# Altium schematic sheet Mother Board Main.SchDoc
size A3 portrait
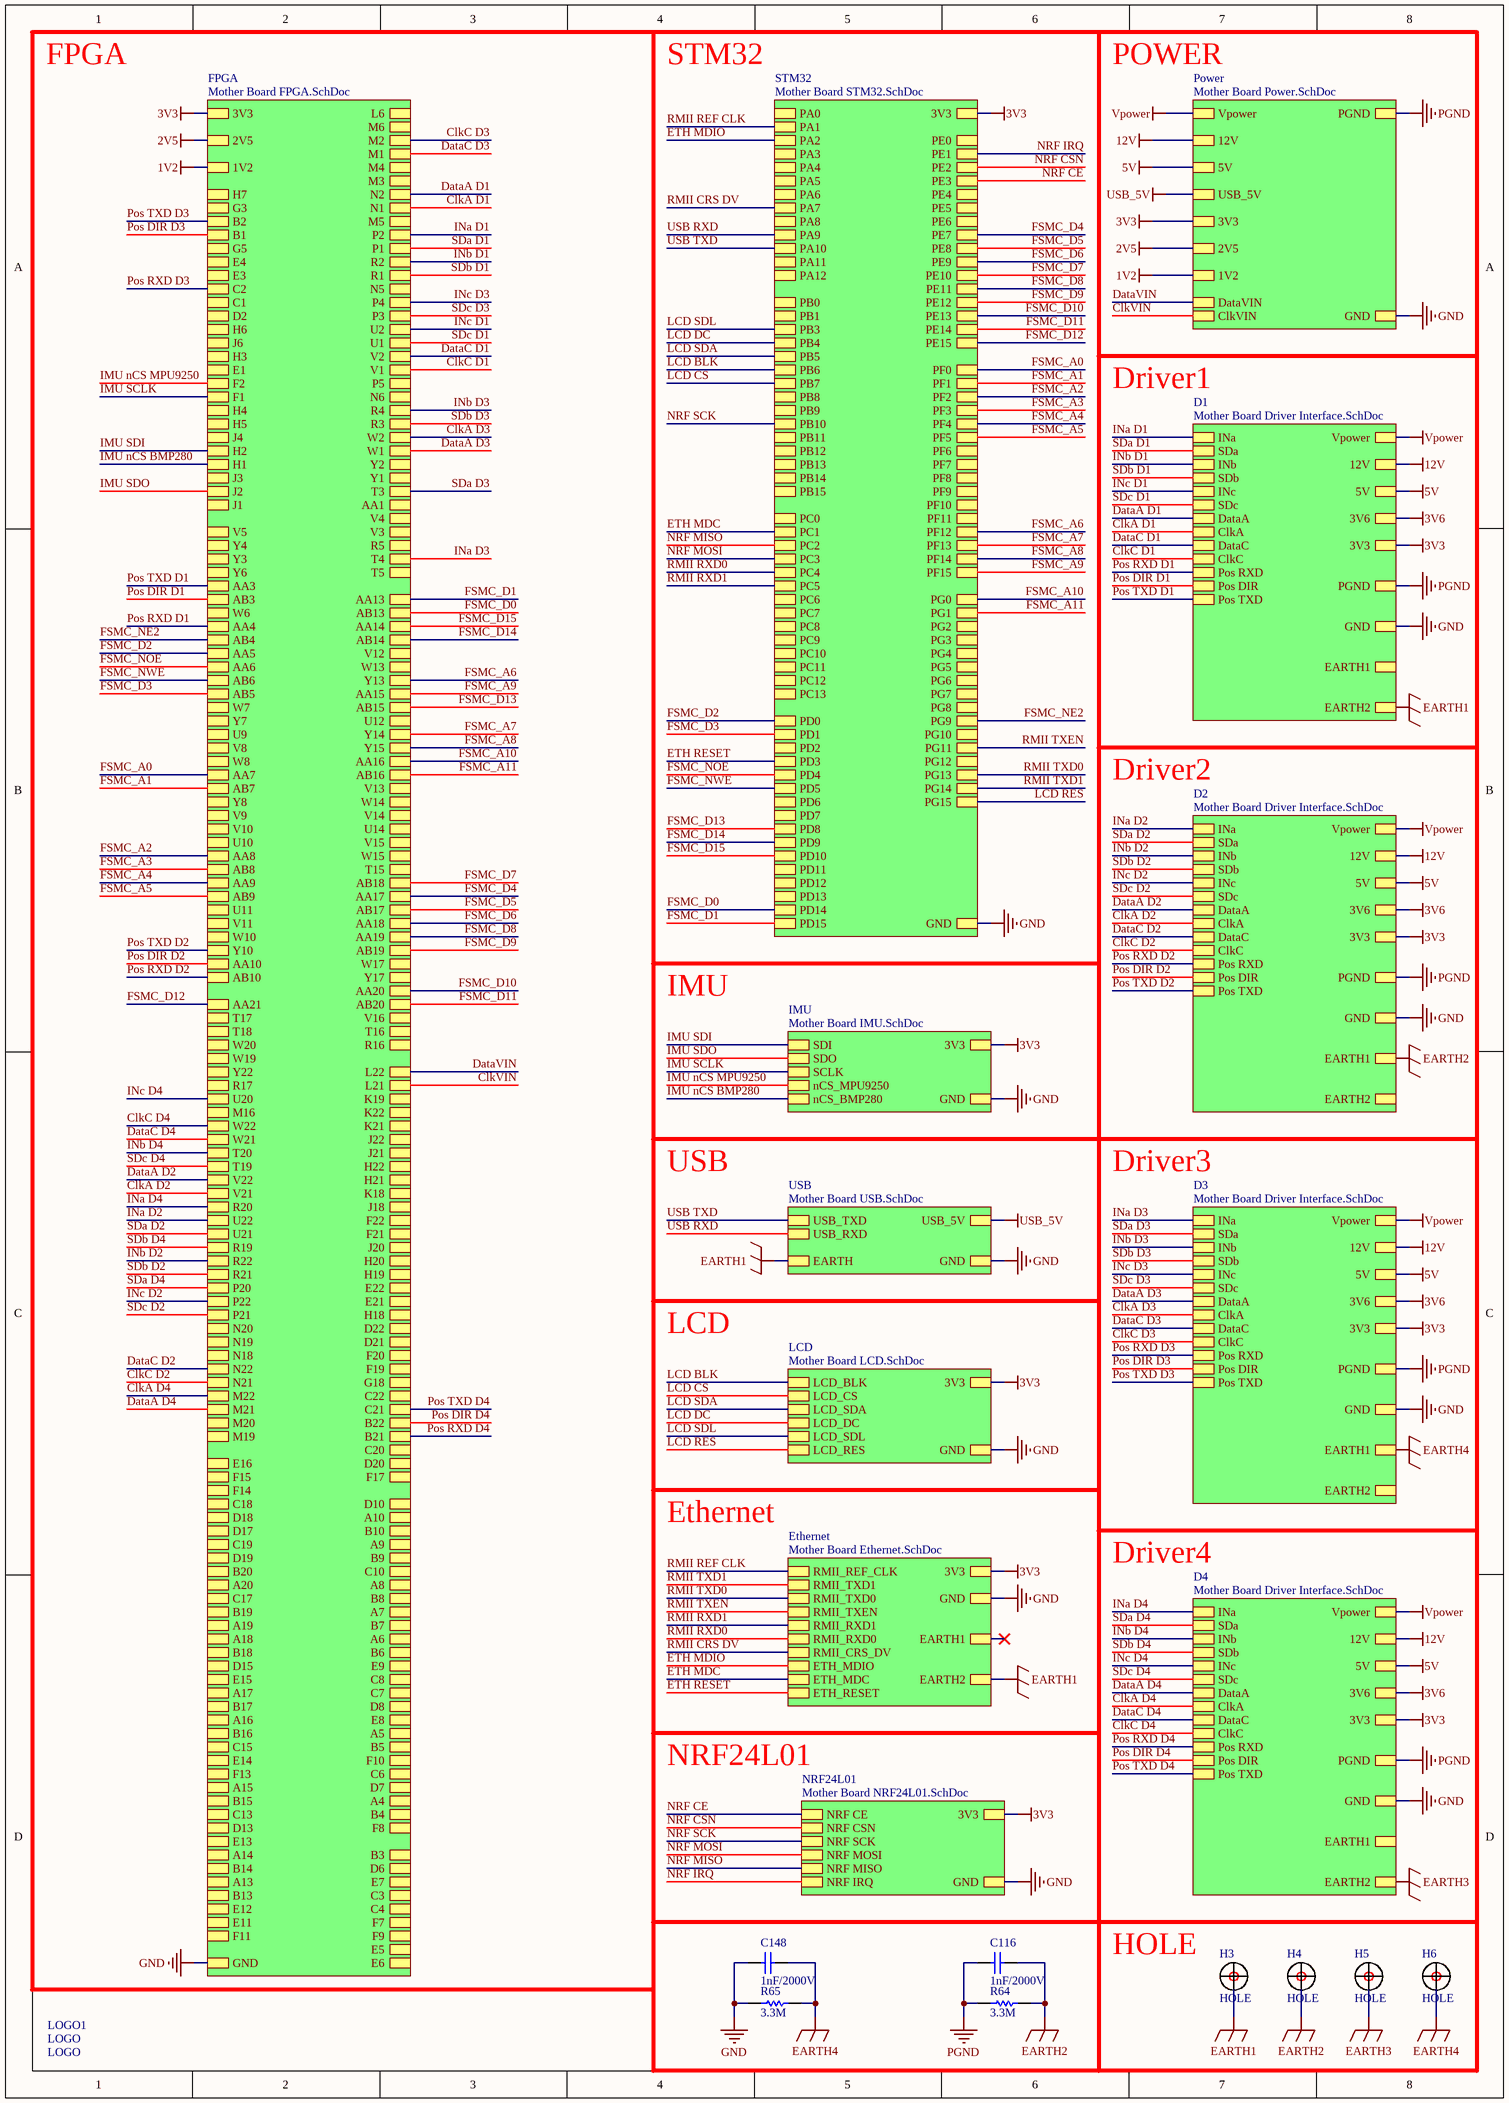
[diagram p0: Mother Board Main.SchDoc]

## Parts
C116  1nF/2000V  [C1206]
C148  1nF/2000V  [C1206]
H3  HOLE  [定位孔 Φ3 1]
H4  HOLE  [定位孔 Φ3 1]
H5  HOLE  [定位孔 Φ3 1]
H6  HOLE  [定位孔 Φ3 1]
LOGO1  LOGO  [LOGO]
R64  3.3M  [R1206]
R65  3.3M  [R1206]

## Sub-sheets
D1 = Mother Board Driver Interface.SchDoc: 12V, PGND, GND, 5V, 3V6, Vpower, INa, INb, INc, SDa, SDb, SDc, DataA, DataC, ClkA, ClkC, Pos DIR, Pos RXD, Pos TXD, 3V3, EARTH1, EARTH2
D2 = Mother Board Driver Interface.SchDoc: 12V, PGND, GND, 5V, 3V6, Vpower, INa, INb, INc, SDa, SDb, SDc, DataA, DataC, ClkA, ClkC, Pos DIR, Pos RXD, Pos TXD, 3V3, EARTH1, EARTH2
D3 = Mother Board Driver Interface.SchDoc: 12V, PGND, GND, 5V, 3V6, Vpower, INa, INb, INc, SDa, SDb, SDc, DataA, DataC, ClkA, ClkC, Pos DIR, Pos RXD, Pos TXD, 3V3, EARTH1, EARTH2
D4 = Mother Board Driver Interface.SchDoc: 12V, PGND, GND, 5V, 3V6, Vpower, INa, INb, INc, SDa, SDb, SDc, DataA, DataC, ClkA, ClkC, Pos DIR, Pos RXD, Pos TXD, 3V3, EARTH1, EARTH2
Ethernet = Mother Board Ethernet.SchDoc: 3V3, GND, RMII_REF_CLK, RMII_TXD1, RMII_TXD0, RMII_TXEN, RMII_RXD1, RMII_RXD0, RMII_CRS_DV, ETH_MDIO, ETH_MDC, ETH_RESET, EARTH1, EARTH2
FPGA = Mother Board FPGA.SchDoc: L6, M6, M2, M1, M4, M3, N2, N1, M5, P2, P1, R2, R1, N5, P4, P3, U2, U1, V2, V1, N6, R4, R3, W2, W1, Y2, Y1, T3, AA1, V4, V3, R5, T4, T5, P5, AA13, AA14, AB14, V12, W13, Y13, AA15, AB15, U12, Y14, Y15, AA16, AB16, V13, W14, V14, U14, V15, W15, T15, AB18, AA17, AB17, AA18, AA19, AB19, W17, Y17, AA20, AB20, V16, T16, R16, L22, L21, K19, K22, K21, J22, J21, H22, H21, K18, J18, F22, F21, J20, H20, H19, E22, E21, H18, D22, D21, F20, F19, G18, C22, C21, B22, B21, C20, D20, F17, D10, A10, B10, A9, B9, C10, A8, B8, A7, B7, A6, B6, E9, C8, C7, D8, E8, A5, B5, F10, C6, D7, A4, B4, F8, B3, D6, E7, C3, C4, F7, F9, E5, E6, H7, G3, B2, B1, G5, E4, E3, C2, C1, D2, H6, J6, H3, E1, F2, F1, H4, H5, J4, H2, H1, J3, J2, J1, V5, Y4, Y3, Y6, AA3, AB3, W6, AA4, AB4, AA5, AA6, AB6, AB5, W7, Y7, U9, V8, W8, AA7, AB7, Y8, V9, V10, U10, AA8, AB8, AA9, AB9, U11, V11, W10, Y10, AA10, AA21, T17, T18, W20, W19, Y22, R17, U20, M16, W22, W21, T20, T19, V22, V21, R20, U22, U21, R19, R22, R21, P20, P22, P21, N20, N19, N18, N22, N21, M22, M21, M20, M19, E16, F15, F14, C18, D18, D17, C19, D19, B20, A20, C17, B19, A19, A18, B18, D15, E15, A17, B17, A16, B16, C15, E14, F13, A15, B15, C13, D13, E13, A14, B14, A13, B13, E12, E11, F11, GND, 3V3, 2V5, 1V2, AB13, AB10
IMU = Mother Board IMU.SchDoc: 3V3, GND, SDI, SDO, SCLK, nCS_MPU9250, nCS_BMP280
LCD = Mother Board LCD.SchDoc: 3V3, GND, LCD_BLK, LCD_CS, LCD_SDA, LCD_DC, LCD_SDL, LCD_RES
NRF24L01 = Mother Board NRF24L01.SchDoc: NRF CE, 3V3, GND, NRF CSN, NRF SCK, NRF MOSI, NRF MISO, NRF IRQ
Power = Mother Board Power.SchDoc: 12V, 5V, Vpower, PGND, GND, DataVIN, ClkVIN, USB_5V, 3V3, 2V5, 1V2
STM32 = Mother Board STM32.SchDoc: GND, 3V3, PA0, PA1, PA2, PA3, PA4, PA5, PA6, PA7, PA8, PA9, PA10, PA11, PA12, PB0, PB1, PE0, PE1, PE2, PE3, PE4, PE5, PE6, PE7, PE8, PE9, PE10, PE11, PE12, PE13, PE14, PE15, PF0, PF1, PF2, PF3, PF4, PF5, PF6, PF7, PF8, PF9, PF10, PF11, PF12, PF13, PF14, PF15, PG0, PG1, PG2, PG3, PG4, PG5, PG6, PG7, PG8, PG9, PG10, PG11, PG12, PG13, PG14, PG15, PB5, PB6, PB7, PB8, PB9, PB10, PB11, PB12, PB13, PB14, PB15, PC0, PC1, PC2, PC3, PC4, PC5, PC6, PC7, PC8, PC9, PC10, PC11, PC12, PC13, PD0, PD1, PD2, PD3, PD4, PD5, PD6, PD7, PD8, PD9, PD10, PD11, PD12, PD13, PD14, PD15, PB3, PB4
USB = Mother Board USB.SchDoc: USB_TXD, USB_RXD, GND, USB_5V, EARTH

## Nets
1V2: sheet Power/1V2, sheet FPGA/1V2
2V5: sheet Power/2V5, sheet FPGA/2V5
3V3: sheet Power/3V3, sheet NRF24L01/3V3, sheet IMU/3V3, sheet LCD/3V3, sheet Ethernet/3V3, sheet D4/3V3, sheet FPGA/3V3, sheet STM32/3V3, sheet D3/3V3, sheet D2/3V3, sheet D1/3V3
3V6: sheet D4/3V6, sheet D3/3V6, sheet D2/3V6, sheet D1/3V6
5V: sheet Power/5V, sheet D4/5V, sheet D3/5V, sheet D2/5V, sheet D1/5V
12V: sheet Power/12V, sheet D4/12V, sheet D3/12V, sheet D2/12V, sheet D1/12V
EARTH1: H3.1 ; sheet USB/EARTH, sheet Ethernet/EARTH2, sheet D1/EARTH2
EARTH2: C116.2 H4.1 R64.1 ; sheet D2/EARTH1
EARTH3: H5.1 ; sheet D4/EARTH2
EARTH4: C148.2 H6.1 R65.1 ; sheet D3/EARTH1
GND: C148.1 R65.2 ; sheet Power/GND, sheet NRF24L01/GND, sheet IMU/GND, sheet USB/GND, sheet LCD/GND, sheet Ethernet/GND, sheet D4/GND, sheet FPGA/GND, sheet STM32/GND, sheet D3/GND, sheet D2/GND, sheet D1/GND
PGND: C116.1 R64.2 ; sheet Power/PGND, sheet D4/PGND, sheet D3/PGND, sheet D2/PGND, sheet D1/PGND
USB_5V: sheet Power/USB_5V, sheet USB/USB_5V
Vpower: sheet Power/Vpower, sheet D4/Vpower, sheet D3/Vpower, sheet D2/Vpower, sheet D1/Vpower
ClkA D1: sheet FPGA/N1, sheet D1/ClkA
ClkA D2: sheet FPGA/V21, sheet D2/ClkA
ClkA D3: sheet FPGA/W2, sheet D3/ClkA
ClkA D4: sheet D4/ClkA, sheet FPGA/M22
ClkC D1: sheet FPGA/V1, sheet D1/ClkC
ClkC D2: sheet FPGA/N21, sheet D2/ClkC
ClkC D3: sheet FPGA/M2, sheet D3/ClkC
ClkC D4: sheet D4/ClkC, sheet FPGA/W22
ClkVIN: sheet Power/ClkVIN, sheet FPGA/L21
DataA D1: sheet FPGA/N2, sheet D1/DataA
DataA D2: sheet FPGA/V22, sheet D2/DataA
DataA D3: sheet FPGA/W1, sheet D3/DataA
DataA D4: sheet D4/DataA, sheet FPGA/M21
DataC D1: sheet FPGA/V2, sheet D1/DataC
DataC D2: sheet FPGA/N22, sheet D2/DataC
DataC D3: sheet FPGA/M1, sheet D3/DataC
DataC D4: sheet D4/DataC, sheet FPGA/W21
DataVIN: sheet Power/DataVIN, sheet FPGA/L22
ETH MDC: sheet Ethernet/ETH_MDC, sheet STM32/PC1
ETH MDIO: sheet Ethernet/ETH_MDIO, sheet STM32/PA2
ETH RESET: sheet Ethernet/ETH_RESET, sheet STM32/PD3
FSMC_A0: sheet FPGA/AA7, sheet STM32/PF0
FSMC_A1: sheet FPGA/AB7, sheet STM32/PF1
FSMC_A2: sheet FPGA/AA8, sheet STM32/PF2
FSMC_A3: sheet FPGA/AB8, sheet STM32/PF3
FSMC_A4: sheet FPGA/AA9, sheet STM32/PF4
FSMC_A5: sheet FPGA/AB9, sheet STM32/PF5
FSMC_A6: sheet FPGA/Y13, sheet STM32/PF12
FSMC_A7: sheet FPGA/Y14, sheet STM32/PF13
FSMC_A8: sheet FPGA/Y15, sheet STM32/PF14
FSMC_A9: sheet FPGA/AA15, sheet STM32/PF15
FSMC_A10: sheet FPGA/AA16, sheet STM32/PG0
FSMC_A11: sheet FPGA/AB16, sheet STM32/PG1
FSMC_D0: sheet FPGA/AB13, sheet STM32/PD14
FSMC_D1: sheet FPGA/AA13, sheet STM32/PD15
FSMC_D2: sheet FPGA/AA5, sheet STM32/PD0
FSMC_D3: sheet FPGA/AB5, sheet STM32/PD1
FSMC_D4: sheet FPGA/AA17, sheet STM32/PE7
FSMC_D5: sheet FPGA/AB17, sheet STM32/PE8
FSMC_D6: sheet FPGA/AA18, sheet STM32/PE9
FSMC_D7: sheet FPGA/AB18, sheet STM32/PE10
FSMC_D8: sheet FPGA/AA19, sheet STM32/PE11
FSMC_D9: sheet FPGA/AB19, sheet STM32/PE12
FSMC_D10: sheet FPGA/AA20, sheet STM32/PE13
FSMC_D11: sheet FPGA/AB20, sheet STM32/PE14
FSMC_D12: sheet FPGA/AA21, sheet STM32/PE15
FSMC_D13: sheet FPGA/AB15, sheet STM32/PD8
FSMC_D14: sheet FPGA/AB14, sheet STM32/PD9
FSMC_D15: sheet FPGA/AA14, sheet STM32/PD10
FSMC_NE2: sheet FPGA/AB4, sheet STM32/PG9
FSMC_NOE: sheet FPGA/AA6, sheet STM32/PD4
FSMC_NWE: sheet FPGA/AB6, sheet STM32/PD5
IMU nCS BMP280: sheet IMU/nCS_BMP280, sheet FPGA/H1
IMU nCS MPU9250: sheet IMU/nCS_MPU9250, sheet FPGA/F2
IMU SCLK: sheet IMU/SCLK, sheet FPGA/F1
IMU SDI: sheet IMU/SDI, sheet FPGA/H2
IMU SDO: sheet IMU/SDO, sheet FPGA/J2
INa D1: sheet FPGA/P2, sheet D1/INa
INa D2: sheet FPGA/U22, sheet D2/INa
INa D3: sheet FPGA/T4, sheet D3/INa
INa D4: sheet D4/INa, sheet FPGA/R20
INb D1: sheet FPGA/R2, sheet D1/INb
INb D2: sheet FPGA/R22, sheet D2/INb
INb D3: sheet FPGA/R4, sheet D3/INb
INb D4: sheet D4/INb, sheet FPGA/T20
INc D1: sheet FPGA/U2, sheet D1/INc
INc D2: sheet FPGA/P22, sheet D2/INc
INc D3: sheet FPGA/P4, sheet D3/INc
INc D4: sheet D4/INc, sheet FPGA/U20
LCD BLK: sheet LCD/LCD_BLK, sheet STM32/PB6
LCD CS: sheet LCD/LCD_CS, sheet STM32/PB7
LCD DC: sheet LCD/LCD_DC, sheet STM32/PB4
LCD RES: sheet LCD/LCD_RES, sheet STM32/PG15
LCD SDA: sheet LCD/LCD_SDA, sheet STM32/PB5
LCD SDL: sheet LCD/LCD_SDL, sheet STM32/PB3
NRF CE: sheet NRF24L01/NRF CE, sheet STM32/PE3
NRF CSN: sheet NRF24L01/NRF CSN, sheet STM32/PE2
NRF IRQ: sheet NRF24L01/NRF IRQ, sheet STM32/PE1
NRF MISO: sheet NRF24L01/NRF MISO, sheet STM32/PC2
NRF MOSI: sheet NRF24L01/NRF MOSI, sheet STM32/PC3
NRF SCK: sheet NRF24L01/NRF SCK, sheet STM32/PB10
Pos DIR D1: sheet FPGA/AB3, sheet D1/Pos DIR
Pos DIR D2: sheet FPGA/AA10, sheet D2/Pos DIR
Pos DIR D3: sheet FPGA/B1, sheet D3/Pos DIR
Pos DIR D4: sheet D4/Pos DIR, sheet FPGA/B22
Pos RXD D1: sheet FPGA/AA4, sheet D1/Pos RXD
Pos RXD D2: sheet FPGA/AB10, sheet D2/Pos RXD
Pos RXD D3: sheet FPGA/C2, sheet D3/Pos RXD
Pos RXD D4: sheet D4/Pos RXD, sheet FPGA/B21
Pos TXD D1: sheet FPGA/AA3, sheet D1/Pos TXD
Pos TXD D2: sheet FPGA/Y10, sheet D2/Pos TXD
Pos TXD D3: sheet FPGA/B2, sheet D3/Pos TXD
Pos TXD D4: sheet D4/Pos TXD, sheet FPGA/C21
RMII CRS DV: sheet Ethernet/RMII_CRS_DV, sheet STM32/PA7
RMII REF CLK: sheet Ethernet/RMII_REF_CLK, sheet STM32/PA1
RMII RXD0: sheet Ethernet/RMII_RXD0, sheet STM32/PC4
RMII RXD1: sheet Ethernet/RMII_RXD1, sheet STM32/PC5
RMII TXD0: sheet Ethernet/RMII_TXD0, sheet STM32/PG13
RMII TXD1: sheet Ethernet/RMII_TXD1, sheet STM32/PG14
RMII TXEN: sheet Ethernet/RMII_TXEN, sheet STM32/PG11
SDa D1: sheet FPGA/P1, sheet D1/SDa
SDa D2: sheet FPGA/U21, sheet D2/SDa
SDa D3: sheet FPGA/T3, sheet D3/SDa
SDa D4: sheet D4/SDa, sheet FPGA/P20
SDb D1: sheet FPGA/R1, sheet D1/SDb
SDb D2: sheet FPGA/R21, sheet D2/SDb
SDb D3: sheet FPGA/R3, sheet D3/SDb
SDb D4: sheet D4/SDb, sheet FPGA/R19
SDc D1: sheet FPGA/U1, sheet D1/SDc
SDc D2: sheet FPGA/P21, sheet D2/SDc
SDc D3: sheet FPGA/P3, sheet D3/SDc
SDc D4: sheet D4/SDc, sheet FPGA/T19
USB RXD: sheet USB/USB_RXD, sheet STM32/PA9
USB TXD: sheet USB/USB_TXD, sheet STM32/PA10

## Notes on the sheet
- FPGA
- STM32
- POWER
- Driver1
- Driver2
- IMU
- USB
- Driver3
- LCD
- Ethernet
- Driver4
- NRF24L01
- HOLE

## Library data of the parts
C116 C148 = Cap
R64 R65 = RES